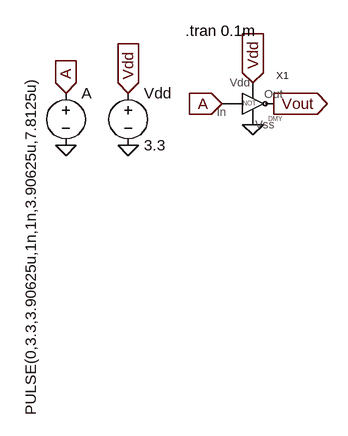
[diagram p0: schematic NOT_test.asc]
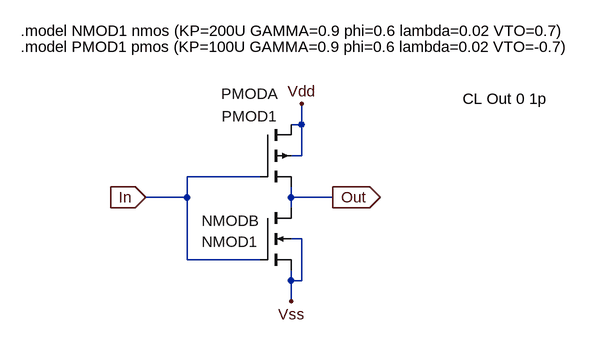
[diagram p1: sub-circuit not.asc]
NOT_test.asc, the LTspice schematic file:
Version 4
SHEET 1 880 680
FLAG 288 128 Vout
IOPIN 288 128 Out
FLAG -32 112 A
IOPIN -32 112 In
FLAG 208 128 A
IOPIN 208 128 In
FLAG 256 96 Vdd
IOPIN 256 96 In
FLAG 64 112 Vdd
IOPIN 64 112 In
FLAG 256 160 0
FLAG -32 192 0
FLAG 64 192 0
SYMBOL voltage -32 96 R0
WINDOW 3 -54 -15 VRight 2
WINDOW 123 0 0 Left 0
WINDOW 39 0 0 Left 0
SYMATTR Value PULSE(0,3.3,3.90625u,1n,1n,3.90625u,7.8125u)
SYMATTR InstName A
SYMBOL voltage 64 96 R0
WINDOW 123 0 0 Left 0
WINDOW 39 0 0 Left 0
SYMATTR InstName Vdd
SYMATTR Value 3.3
SYMBOL not 240 128 R0
SYMATTR InstName X1
TEXT 152 16 Left 2 !.tran 0.1m

not.asc, the sub-circuit schematic file:
Version 4
SHEET 1 880 680
WIRE 288 -96 288 -128
WIRE 288 -96 272 -96
WIRE 288 -48 288 -96
WIRE 288 -48 272 -48
WIRE 224 -16 112 -16
WIRE 112 16 112 -16
WIRE 112 16 48 16
WIRE 272 16 272 0
WIRE 336 16 272 16
WIRE 272 32 272 16
WIRE 112 112 112 16
WIRE 288 80 272 80
WIRE 224 112 112 112
WIRE 272 144 272 128
WIRE 288 144 288 80
WIRE 288 144 272 144
WIRE 272 176 272 144
FLAG 48 16 In
IOPIN 48 16 In
FLAG 336 16 Out
IOPIN 336 16 Out
FLAG 272 176 Vss
FLAG 288 -128 Vdd
SYMBOL pmos4 224 -96 R0
WINDOW 0 -60 -47 Left 2
WINDOW 3 -59 -13 Left 2
SYMATTR InstName PMODA
SYMATTR Value PMOD1
SYMATTR Value2 l=1u w=50u
SYMBOL nmos4 224 32 R0
WINDOW 0 -90 20 Left 2
WINDOW 3 -90 52 Left 2
SYMATTR InstName NMODB
SYMATTR Value NMOD1
SYMATTR Value2 l=1u w=100u
TEXT -144 -240 Left 2 !.model NMOD1 nmos (KP=200U GAMMA=0.9 phi=0.6 lambda=0.02 VTO=0.7)
TEXT -144 -216 Left 2 !.model PMOD1 pmos (KP=100U GAMMA=0.9 phi=0.6 lambda=0.02 VTO=-0.7)
TEXT 536 -136 Left 2 !CL Out 0 1p

The netlist it stands for:
* NOT_test.asc
V§A A 0 PULSE(0,3.3,3.90625u,1n,1n,3.90625u,7.8125u)
Vdd Vdd 0 3.3
XX1 Vdd 0 A Vout not

* block symbol definitions
.subckt not Vdd Vss In Out
M§PMODA Vdd In Out Vdd PMOD1 l=1u w=50u
M§NMODB Out In Vss Vss NMOD1 l=1u w=100u
.model NMOD1 nmos (KP=200U GAMMA=0.9 phi=0.6 lambda=0.02 VTO=0.7)
.model PMOD1 pmos (KP=100U GAMMA=0.9 phi=0.6 lambda=0.02 VTO=-0.7)
CL Out 0 1p
.ends not

.model NMOS NMOS
.model PMOS PMOS
.lib standard.mos
.tran 0.1m
.backanno
.end

* Results of the author's LTspice run, read from the files saved beside the schematic
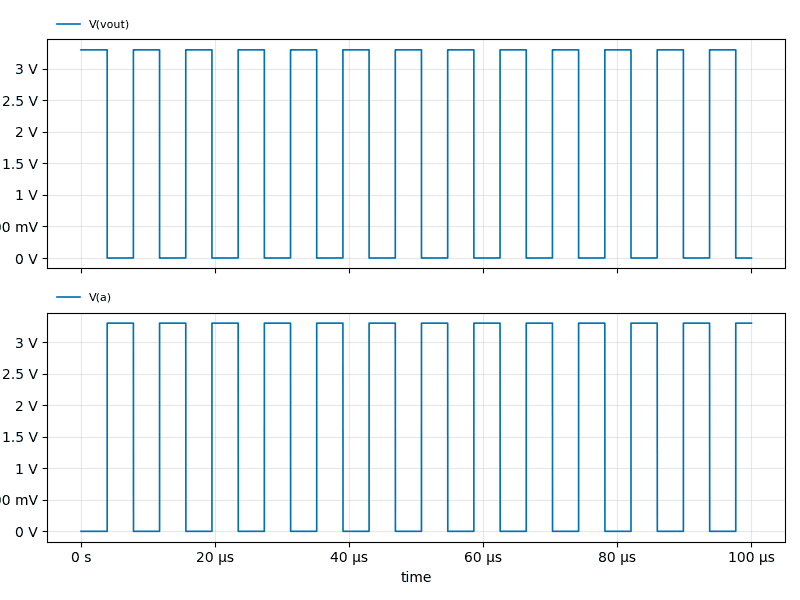
[diagram p2: Transient Analysis of NOT_test.asc, plotted from the saved traces]
* Transient Analysis, 1 run:
*   V(vout): min 0 V, max 3.3 V, average 1.675 V, rms 2.351 V, last 0 V
*   V(a): min 0 V, max 3.3 V, average 1.625 V, rms 2.315 V, last 3.3 V